# Altium schematic sheet pripherals.SchDoc
size A3
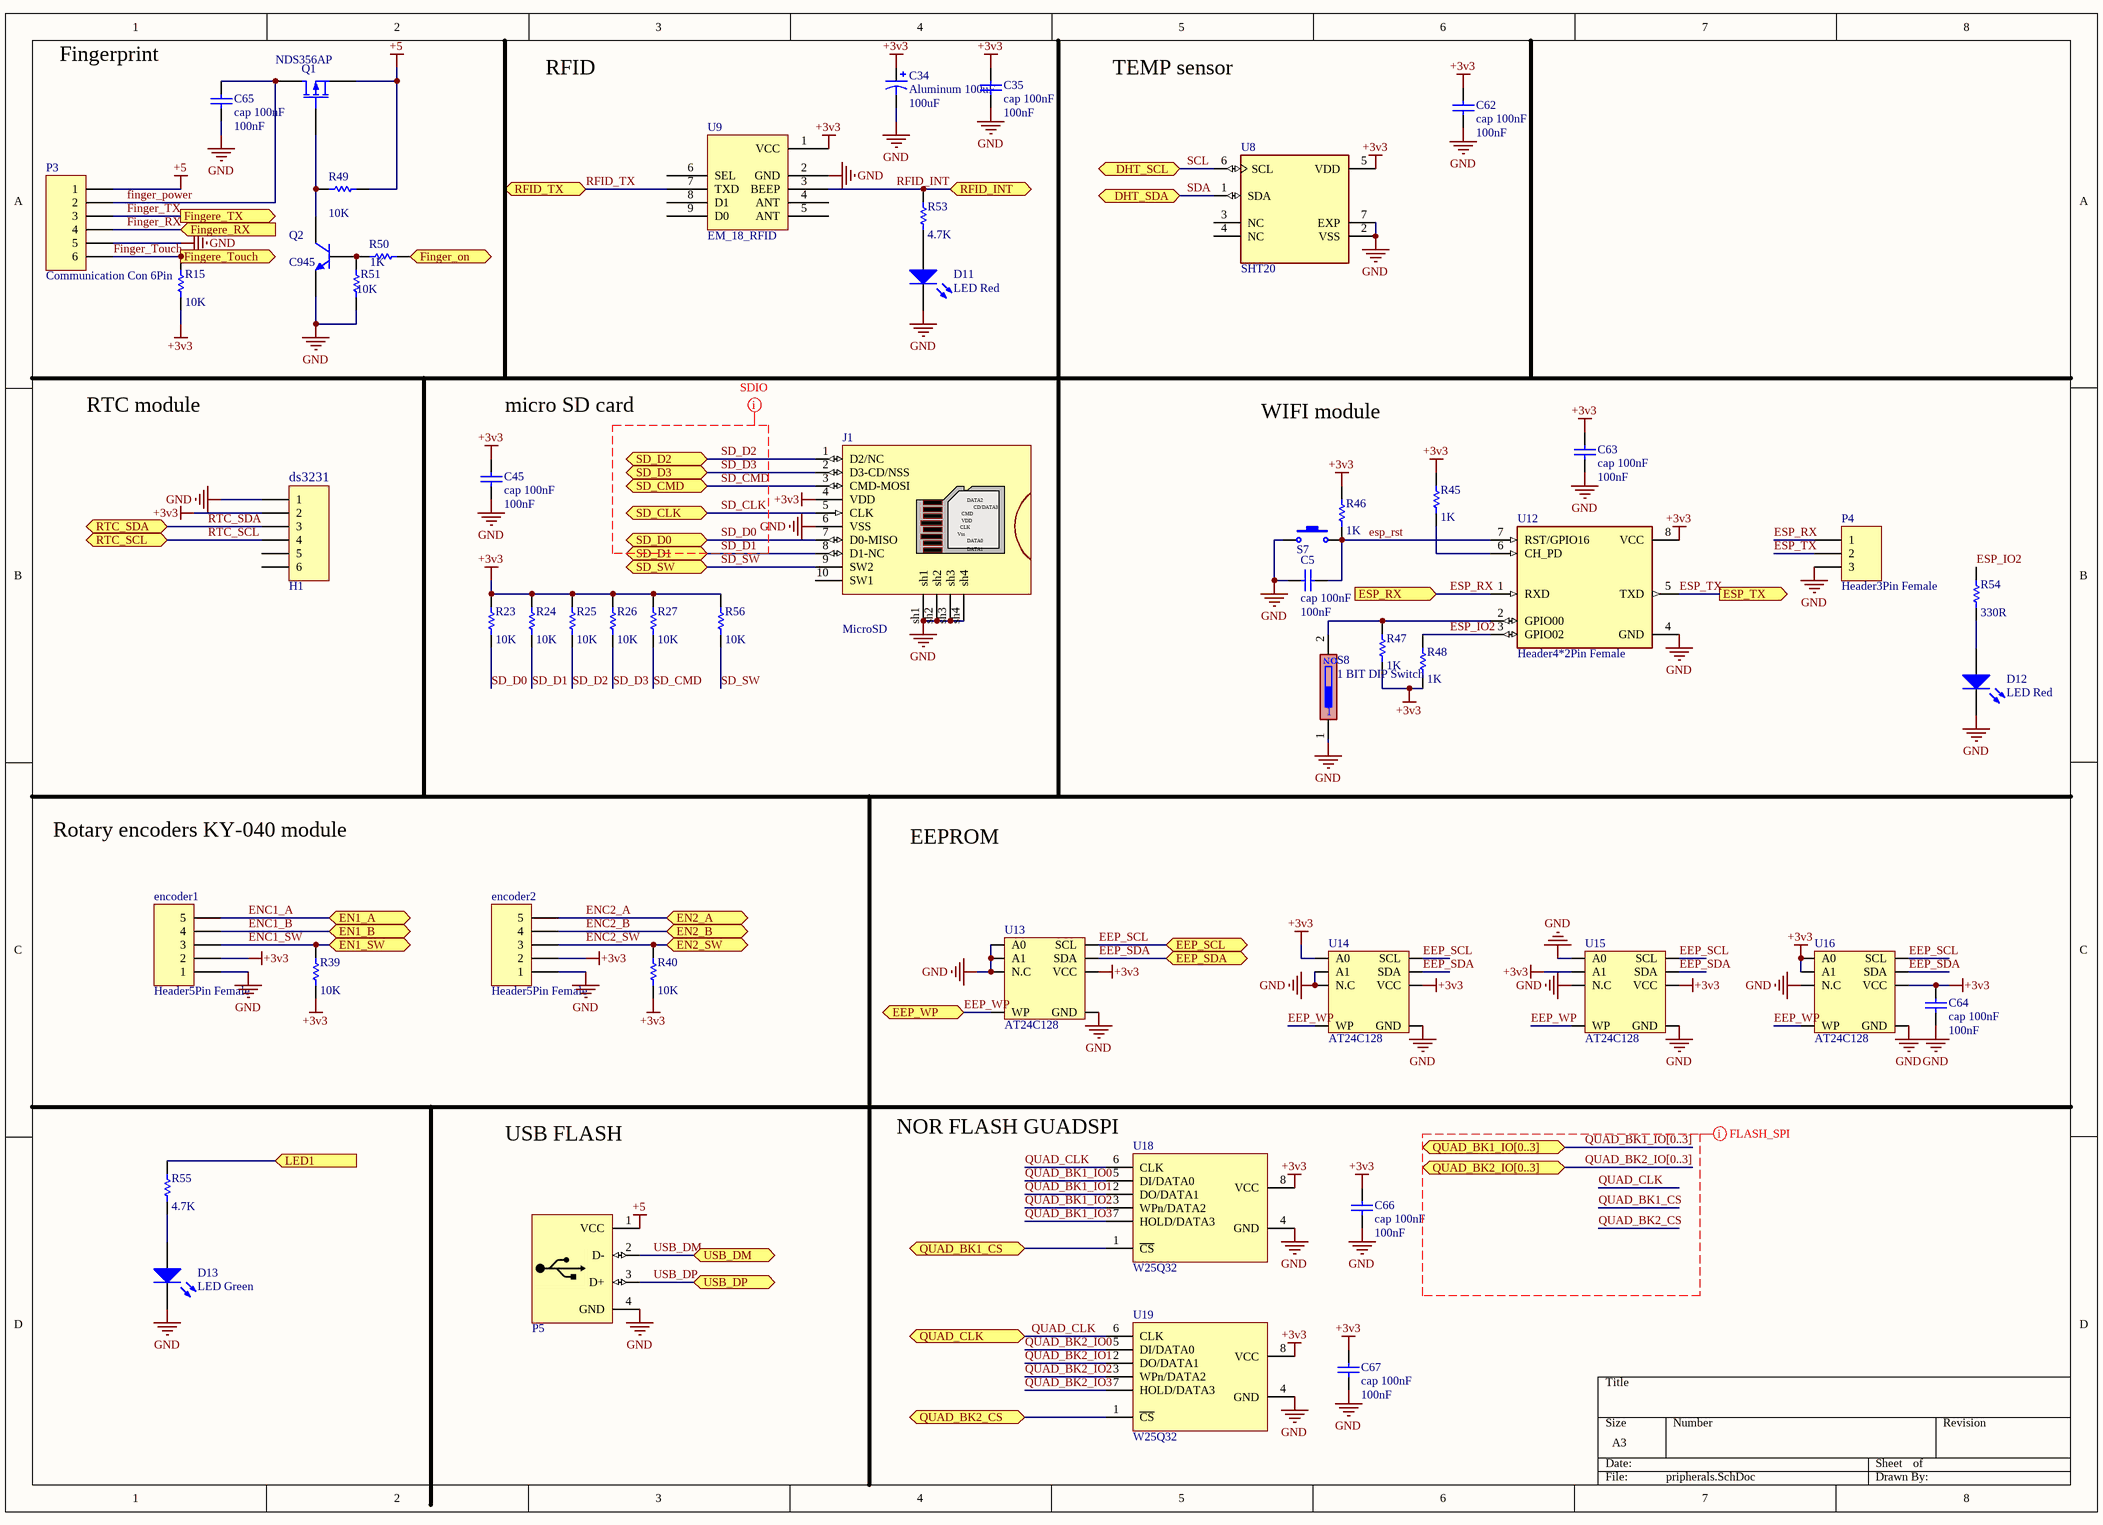
[diagram p0: pripherals.SchDoc]

## Parts
C5  cap 100nF  value 100nF  [Cap 805]
C34  Aluminum 100uF  value 100uF  [Cap SMD 100UF 35~50v]
C35  cap 100nF  value 100nF  [Cap 805]
C45  cap 100nF  value 100nF  [Cap 805]
C62  cap 100nF  value 100nF  [Cap 805]
C63  cap 100nF  value 100nF  [Cap 805]
C64  cap 100nF  value 100nF  [Cap 805]
C65  cap 100nF  value 100nF  [Cap 805]
C66  cap 100nF  value 100nF  [Cap 805]
C67  cap 100nF  value 100nF  [Cap 805]
D11  LED Red  [0805-LED]
D12  LED Red  [0805-LED]
D13  LED Green  [0805-LED]
encoder1  Header5Pin Female  [ky-040-encoder]
encoder2  Header5Pin Female  [ky-040-encoder]
H1  Header6Pin Female Right  [ds3231]  (value not drawn)
J1  MicroSD  [SD_card]
P3  Communication Con 6Pin  [HDR1X6]
P4  Header3Pin Female  [HDR1X3]
P5  USB Connector A Type Femal  [USB2.5-2H4C]  (value not drawn)
Q1  NDS356AP  [SOT23_N]
Q2  C945  [SOT23_N]
R15  value 10K  [RES 0805 (2012X06L)]  (hidden comment: Res 10K)
R23  value 10K  [RES 0805 (2012X06L)]  (hidden comment: Res 10K)
R24  value 10K  [RES 0805 (2012X06L)]  (hidden comment: Res 10K)
R25  value 10K  [RES 0805 (2012X06L)]  (hidden comment: Res 10K)
R26  value 10K  [RES 0805 (2012X06L)]  (hidden comment: Res 10K)
R27  value 10K  [RES 0805 (2012X06L)]  (hidden comment: Res 10K)
R39  value 10K  [RES 0805 (2012X06L)]  (hidden comment: Res 10K)
R40  value 10K  [RES 0805 (2012X06L)]  (hidden comment: Res 10K)
R45  value 1K  [RES 0805 (2012X06L)]  (hidden comment: Res 1K)
R46  value 1K  [RES 0805 (2012X06L)]  (hidden comment: Res 1K)
R47  value 1K  [RES 0805 (2012X06L)]  (hidden comment: Res 1K)
R48  value 1K  [RES 0805 (2012X06L)]  (hidden comment: Res 1K)
R49  value 10K  [RES 0805 (2012X06L)]  (hidden comment: Res 10K)
R50  value 1K  [RES 0805 (2012X06L)]  (hidden comment: Res 1K)
R51  value 10K  [RES 0805 (2012X06L)]  (hidden comment: Res 10K)
R53  value 4.7K  [RES 0805 (2012X06L)]  (hidden comment: Res 4.7K)
R54  value 330R  [RES 0805 (2012X06L)]  (hidden comment: Res 330R)
R55  value 4.7K  [RES 0805 (2012X06L)]  (hidden comment: Res 4.7K)
R56  value 10K  [RES 0805 (2012X06L)]  (hidden comment: Res 10K)
S7  Switch PB  [Switch - Push to On]  (value not drawn)
S8  1 BIT DIP Switch  [DIP Switch x1]
U8  SHT20  [XDCR_SHT20]
U9  EM_18_RFID  [EM-18]
U12  Header4*2Pin Female  [ESP8266-01/ESP-01]
U13  AT24C128  [SOIC-8]
U14  AT24C128  [SOIC-8]
U15  AT24C128  [SOIC-8]
U16  AT24C128  [SOIC-8]
U18  W25Q32  [WSON-8x6]
U19  W25Q32  [WSON-8x6]

## Ports
DHT_SCL (bidir), DHT_SDA (bidir), EEP_SCL (bidir), EEP_SDA (bidir), EEP_WP (bidir), EN1_A (bidir), EN1_B (bidir), EN1_SW (bidir), EN2_A (bidir), EN2_B (bidir), EN2_SW (bidir), ESP_RX (in), ESP_TX (out), Finger_on (bidir), Fingere_RX (in), Fingere_Touch (out), Fingere_TX (out), LED1 (in), QUAD_BK1_CS (bidir), QUAD_BK1_IO[0..3] (bidir), QUAD_BK2_CS (bidir), QUAD_BK2_IO[0..3] (bidir), QUAD_CLK (bidir), RFID_INT (bidir), RFID_TX (bidir), RTC_SCL (bidir), RTC_SDA (bidir), SD_CLK (bidir), SD_CMD (bidir), SD_D0 (bidir), SD_D1 (bidir), SD_D2 (bidir), SD_D3 (bidir), SD_SW (bidir), USB_DM (bidir), USB_DP (bidir)

## Nets
+3v3: C34.1 C35.2 C45.2 C62.2 C63.2 C64.2 C66.2 C67.2 encoder1.2 encoder2.2 H1.2 J1.4(VDD) R15.1 R23.2 R24.2 R25.2 R26.2 R27.2 R39.1 R40.1 R45.1 R46.1 R47.2 R48.2 R56.2 U8.5(VDD) U9.1(VCC) U12.8(VCC) U13.8(VCC) U14.1(A0) U14.8(VCC) U15.2(A1) U15.8(VCC) U16.1(A0) U16.2(A1) U16.8(VCC) U18.8(VCC) U19.8(VCC)
+5: P3.1 P5.1(VCC) Q1.3(S) R49.1
GND: C5.2 C34.2 C35.1 C45.1 C62.1 C63.1 C64.1 C65.1 C66.1 C67.1 D11.2(K) D12.2(K) D13.2(K) encoder1.1 encoder2.1 H1.1 J1.6(VSS) J1.sh1 J1.sh2 J1.sh3 J1.sh4 P3.5 P4.3 P5.4(GND) Q2.2(E) R51.1 S7.1 S8.1 U8.2(VSS) U8.7(EXP) U9.2(GND) U12.4(GND) U13.1(A0) U13.2(A1) U13.3(N.C) U13.4(GND) U14.2(A1) U14.3(N.C) U14.4(GND) U15.1(A0) U15.3(N.C) U15.4(GND) U16.3(N.C) U16.4(GND) U18.4(GND) U19.4(GND)
EEP_SCL: U13.6(SCL) U14.6(SCL) U15.6(SCL) U16.6(SCL) ; port EEP_SCL
EEP_SDA: U13.5(SDA) U14.5(SDA) U15.5(SDA) U16.5(SDA) ; port EEP_SDA
EEP_WP: U13.7(WP) U14.7(WP) U15.7(WP) U16.7(WP) ; port EEP_WP
ENC1_A: encoder1.5 ; port EN1_A
ENC1_B: encoder1.4 ; port EN1_B
ENC1_SW: encoder1.3 R39.2 ; port EN1_SW
ENC2_A: encoder2.5 ; port EN2_A
ENC2_B: encoder2.4 ; port EN2_B
ENC2_SW: encoder2.3 R40.2 ; port EN2_SW
ESP_IO2: R48.1 R54.2 U12.3(GPIO02)
esp_rst: C5.1 R46.2 S7.2 U12.7(RST/GPIO16)
ESP_RX: P4.1 U12.1(RXD) ; port ESP_RX
ESP_TX: P4.2 U12.5(TXD) ; port ESP_TX
Finger_on: R50.1 ; port Finger_on
finger_power: C65.2 P3.2 Q1.1(D)
Finger_RX: P3.4 ; port Fingere_RX
Finger_Touch: P3.6 R15.2 ; port Fingere_Touch
Finger_TX: P3.3 ; port Fingere_TX
LED1: R55.2 ; port LED1
QUAD_BK1_CS: U18.1(~{CS}) ; port QUAD_BK1_CS
QUAD_BK1_IO0: U18.5(DI/DATA0)
QUAD_BK1_IO1: U18.2(DO/DATA1)
QUAD_BK1_IO2: U18.3(WPn/DATA2)
QUAD_BK1_IO3: U18.7(HOLD/DATA3)
QUAD_BK2_CS: U19.1(~{CS}) ; port QUAD_BK2_CS
QUAD_BK2_IO0: U19.5(DI/DATA0)
QUAD_BK2_IO1: U19.2(DO/DATA1)
QUAD_BK2_IO2: U19.3(WPn/DATA2)
QUAD_BK2_IO3: U19.7(HOLD/DATA3)
QUAD_CLK: U18.6(CLK) U19.6(CLK) ; port QUAD_CLK
RFID_INT: R53.2 U9.3(BEEP) ; port RFID_INT
RFID_TX: U9.7(TXD) ; port RFID_TX
RTC_SCL: H1.4 ; port RTC_SCL
RTC_SDA: H1.3 ; port RTC_SDA
SCL: U8.6(SCL) ; port DHT_SCL
SD_CLK: J1.5(CLK) ; port SD_CLK
SD_CMD: J1.3(CMD-MOSI) R27.1 ; port SD_CMD
SD_D0: J1.7(D0-MISO) R23.1 ; port SD_D0
SD_D1: J1.8(D1-NC) R24.1 ; port SD_D1
SD_D2: J1.1(D2/NC) R25.1 ; port SD_D2
SD_D3: J1.2(D3-CD/NSS) R26.1 ; port SD_D3
SD_SW: J1.9(SW2) R56.1 ; port SD_SW
SDA: U8.1(SDA) ; port DHT_SDA
USB_DM: P5.2(D-) ; port USB_DM
USB_DP: P5.3(D+) ; port USB_DP
NetD11_1: D11.1(A) R53.1
NetD12_1: D12.1(A) R54.1
NetD13_1: D13.1(A) R55.1
NetQ1_2: Q1.2(G) Q2.3(C) R49.2
NetQ2_1: Q2.1(B) R50.2 R51.2
NetR45_2: R45.2 U12.6(CH_PD)
NetR47_1: R47.1 S8.2 U12.2(GPIO00)

Not connected (* = marked no-connect by the designer): H1 5 6; J1 10(SW1); U8 3(NC) 4(NC); U9 4(ANT) 5(ANT) 6(SEL) 8(D1) 9(D0)

## Buses and harness runs
bus QUAD_BK1_IO[0..3] = port QUAD_BK1_IO[0..3]
bus QUAD_BK2_IO[0..3] = port QUAD_BK2_IO[0..3]

## Layout directives
net class SDIO: SD_CLK, SD_CMD, SD_D0, SD_D1, SD_D2, SD_D3
net class FLASH_SPI: QUAD_BK1_CS, QUAD_BK1_IO[0..3], QUAD_BK2_CS, QUAD_BK2_IO[0..3], QUAD_CLK

## Notes on the sheet
- (near C65) Fingerprint
- RFID
- TEMP sensor
- RTC module
- micro SD card
- WIFI module
- (near H1) ds3231
- Rotary encoders KY-040 module
- EEPROM
- NOR FLASH GUADSPI
- USB FLASH
- (in symbol DIP Switch 1) ON
- (in symbol MicroSD) DATA2; CD/DATA3; CMD; Vss; DATA0; DATA1

## Library data of the parts
C5 C35 C45 C62-C67 = Cap: Capacitor; Published: 8-Jun-2000; LatestRevisionDate: 17-Jul-2002; LatestRevisionNote: Re-released for DXP Platform.; PackageReference: RAD-0.3; Publisher: Altium Limited; PackageDescription: Radial Cap, Thru-Hole; 2 Leads; 0.3 in Pin Spacing
C34 = Cap Pol1: Polarized Capacitor Aluminum; Published: 8-Jun-2000; LatestRevisionDate: 17-Jul-2002; LatestRevisionNote: Re-released for DXP Platform.; PackageReference: RB7.6-15; Publisher: Altium Limited; PackageDescription: Polarized Capacitor (Radial); 2 Leads
D11-D13 = LED0: LED SMD; pin to pad: 1>A 2>C; Published: 8-Jun-2000; LatestRevisionDate: 08-Jul-2005; LatestRevisionNote: Mech Layer 1 removed.; PackageReference: LED-0; Publisher: Altium Limited; PackageDescription: LED; 2 Leads
encoder1 encoder2 = Header 5: Header, 5-Pin; LatestRevisionDate: 17-Jul-2002; LatestRevisionNote: Re-released for DXP Platform.; Publisher: Altium Limited
H1 = H-1x6: RTC module
J1 = MicroSD: Created by:: altium designer (M.Hariri); VALUE: MicroSD
P3 = Header 6: Finger print module; LatestRevisionDate: 17-Jul-2002; LatestRevisionNote: Re-released for DXP Platform.; Publisher: Altium Limited
P4 = Header 3: Header, 3-Pin; LatestRevisionDate: 17-Jul-2002; LatestRevisionNote: Re-released for DXP Platform.; Publisher: Altium Limited
P5 = USB A-Type: USB Connector-A Type Femal
Q1 = MOSFET-P: P-Channel MOSFET; pin to pad: 2>3 3>2; Published: 8-Jun-2000; LatestRevisionDate: 17-Jul-2002; LatestRevisionNote: Re-released for DXP Platform.; PackageVersion: 1995/1996; PackageReference: E3; Publisher: Altium Limited; PackageDescription: TO, Flat Index; 3 In-Line, Axial Leads; Body Dia. 4.6mm; Lead Dia. 0.5 mm (max)
Q2 = C945: NPN Silicon Epitaxial Planar Transistor; Published: 2017-2-8; LatestRevisionDate: 2017; LatestRevisionNote: IPC-7351 Footprint Added.; DatasheetVersion: 2017; PackageVersion: 2017-2-8; PackageReference: SOT23; Publisher: Abbas Basereh; PackageDescription: 3-Pin SOT-23 Package 0.95 mm Pitch, 2.3 mm Lead Span; ComponentLink1Description: Manufacturer Link; ComponentLink1URL: http://www.taitroncomponents.com/; ComponentLink2Description: Datasheet; ComponentLink2URL: http://www.taitroncomponents.com/
R15 R23-R27 R39 R40 R45-R51 R53-R56 = Res1: Resistor; Published: 8-Jun-2000; LatestRevisionDate: 17-Jul-2002; LatestRevisionNote: Re-released for DXP Platform.; PackageReference: AXIAL-0.3; Publisher: Altium Limited; PackageDescription: Axial Device, Thru-Hole; 2 Leads; 0.3 in Pin Spacing
S7 = Switch PB: Push Button Switch
S8 = DIP Switch 1: Program
U8 = SHT20: SENSOR HUMID/TEMP 3V I2C 3% SMD; MF: Sensirion AG; MP: SHT20; Package: DFN-6 Sensirion; Availability: Unavailable; Price: None; SnapEDA_Link: https://www.snapeda.com/parts/SHT20/Sensirion%20AG/view-part/53498/?ref=snap; Value: *
U9 = EM_18: RFID reader
U12 = ESP8266-01/ESP-01: ESP-01 wifi module; MF: AI-Thinker; Package: None; Availability: Unavailable; MP: ESP8266-01/ESP-01; Value: *; SnapEDA_Link: https://www.snapeda.com/parts/ESP8266-01/ESP-01/AI-Thinker/view-part/106413/?ref=snap; Price: None
U13-U16 = AT24C128: EEPROM
U18 U19 = W25Q32: NOR flash